# Altium schematic sheet LCD.SchDoc
size A4
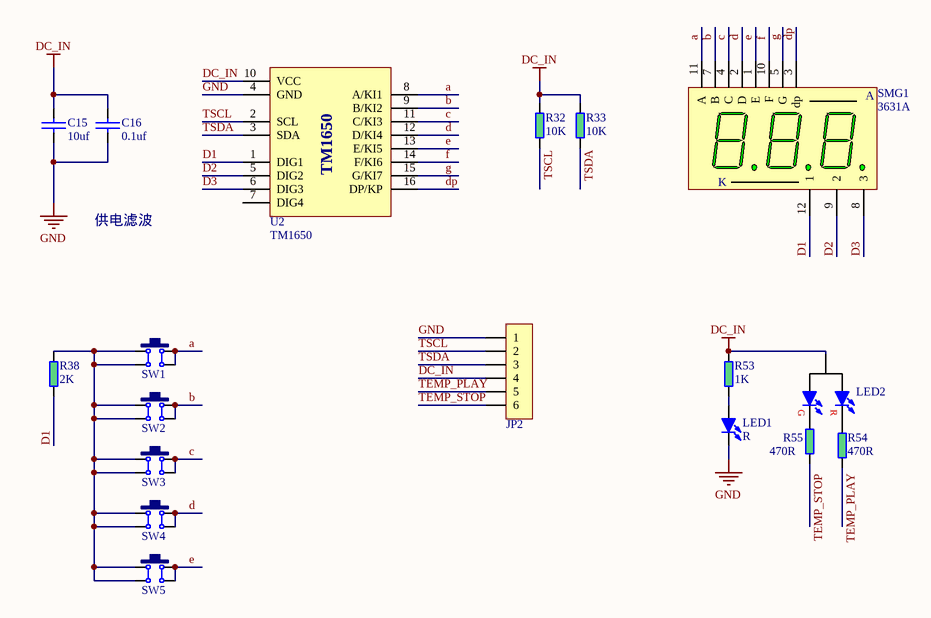
[diagram p0: LCD.SchDoc]

## Parts
C15  value 10uf  [C 0603]  (hidden comment: 04.Cap)
C16  value 0.1uf  [C 0603]  (hidden comment: 04.Cap)
JP2  Pin06  [XH2.54 6P]  (value not drawn)
LED1  R  [LED 3mm R]
LED2  15.Diode - PLED - double  [LED 3mm R/G]  (value not drawn)
R32  10K  [R 0603]
R33  10K  [R 0603]
R38  2K  [R 0603]
R53  1K  [R 0603]
R54  470R  [R 0603]
R55  470R  [R 0603]
SMG1  3631A  [SMG 0.36-3P]
SW1  TSW DIP-6x6  [TSW DIP-6*6]  (value not drawn)
SW2  TSW DIP-6x6  [TSW DIP-6*6]  (value not drawn)
SW3  TSW DIP-6x6  [TSW DIP-6*6]  (value not drawn)
SW4  TSW DIP-6x6  [TSW DIP-6*6]  (value not drawn)
SW5  TSW DIP-6x6  [TSW DIP-6*6]  (value not drawn)
U2  TM1650  [SOP16]

## Nets
DC_IN: C15.1 C16.1 JP2.4 LED2.A R32.2 R33.2 R53.2 U2.10(VCC)
GND: C15.2 C16.2 JP2.1 LED1.K U2.4(GND)
a: SMG1.11(A) SW1.C SW1.D U2.8(A/KI1)
b: SMG1.7(B) SW2.C SW2.D U2.9(B/KI2)
c: SMG1.4(C) SW3.C SW3.D U2.11(C/KI3)
d: SMG1.2(D) SW4.C SW4.D U2.12(D/KI4)
D1: R38.1 SMG1.12(1) U2.1(DIG1)
D2: SMG1.9(2) U2.5(DIG2)
D3: SMG1.8(3) U2.6(DIG3)
dp: SMG1.3(dp) U2.16(DP/KP)
e: SMG1.1(E) SW5.C SW5.D U2.13(E/KI5)
f: SMG1.10(F) U2.14(F/KI6)
g: SMG1.5(G) U2.15(G/KI7)
TEMP_PLAY: JP2.5 R54.1
TEMP_STOP: JP2.6 R55.1
TSCL: JP2.2 R32.1 U2.2(SCL)
TSDA: JP2.3 R33.1 U2.3(SDA)
NetLED1_A: LED1.A R53.1
NetLED2_G: LED2.G R55.2
NetLED2_R: LED2.R R54.2
NetR38_2: R38.2 SW1.A SW1.B SW2.A SW2.B SW3.A SW3.B SW4.A SW4.B SW5.A SW5.B

Not connected (* = marked no-connect by the designer): U2 7(DIG4)

## Notes on the sheet
- 供电滤波
- (in symbol 3631A) K

## Library data of the parts
C15 C16 = 04.Cap: 电容
LED1 = 15.Diode - LED: LED
R32 R33 R38 R53-R55 = 01.Res: 电阻
SMG1 = 3631A: 0.36寸3位共阴数码管; 版权归属: 源创客; BOM名称: 0.36寸3位共阴; 学习资源: www.ooocke.com
SW1-SW5 = TSW DIP-6x6: 6x6轻触开关; BOM名称: 6x6轻触开关
U2 = TM1650: 数码管驱动芯片